# Altium schematic sheet Sheet1.SchDoc: =GlobalProjectName
size 410 x 297 mm; ApprovedBy: Королёв Д.М.; CheckedBy: Королёв Д.М.; Author: Тришин В.М.; Organization: СПбПУ 43328/1; DocumentNumber: МК 101801.001 Э3; SheetNumber: 1; SheetTotal: 1; PageSetup: Record=PageOptions|CenterHorizontal=True|CenterVertical=True|PrintScale=1.00|XCorrection=1.00|YCorrection=1.00|PrintKind=1|BorderSize=5000000|LeftOffset=0|BottomOffset=0|Orientation=2|PaperLength=1000|PaperWidth=1000|Scale=100|PaperSource=15|PrintQuality=1200|MediaType=1|DitherType=10|PaperKind=A3|PrintScaleMode=1; Weight: -; ScaleFactor: -
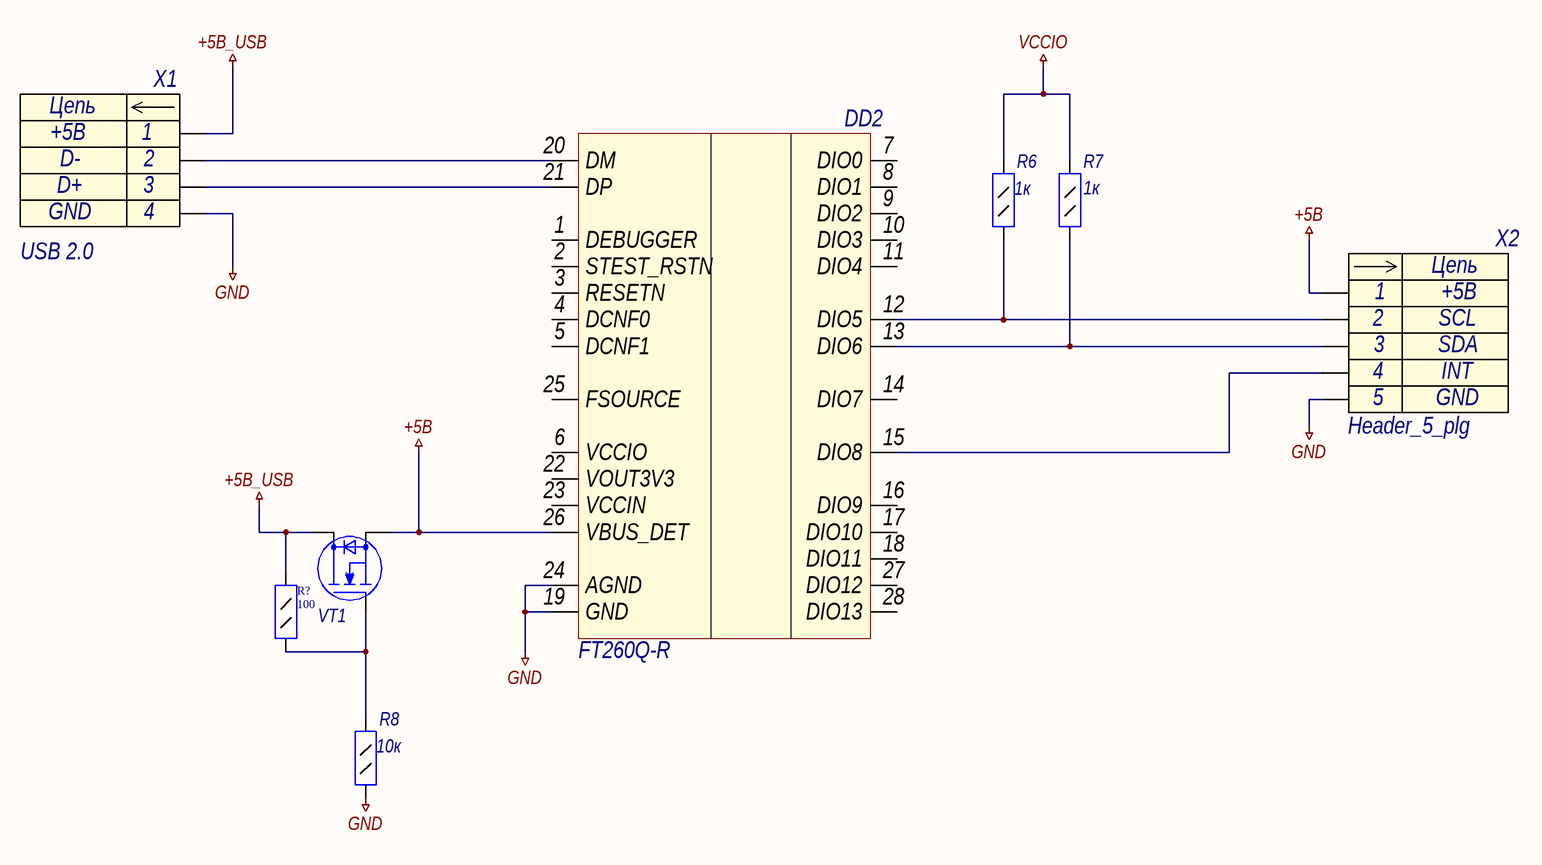
[diagram p0: Sheet1.SchDoc]

## Parts
DD2  FT260Q-R
R6  value 1к  [R0805]  (hidden comment: Resistor_0,125Вт)
R7  value 1к  [R0805]  (hidden comment: Resistor_0,125Вт)
R8  value 10к  [R0805]  (hidden comment: Resistor_0,125Вт)
R?  value 100  [R0805]  (hidden comment: Resistor_0,125Вт)
VT1  N-MOSFET  [SOT23-3]  (value not drawn)
X1  USB 2.0  [PLS-4]
X2  Header_5_plg  [PLS-5]

## Nets
+5В: DD2.26(VBUS_DET) VT1.2(S) X2.1
+5В_USB: R?.2 VT1.3(D) X1.1
GND: DD2.19(GND) DD2.24(AGND) R8.1 X1.4 X2.5
VCCIO: R6.2 R7.2
NetDD2_12: DD2.12(DIO5) R6.1 X2.2
NetDD2_13: DD2.13(DIO6) R7.1 X2.3
NetDD2_15: DD2.15(DIO8) X2.4
NetDD2_20: DD2.20(DM) X1.2
NetDD2_21: DD2.21(DP) X1.3
NetR8_2: R8.2 R?.1 VT1.1(G)

Not connected (* = marked no-connect by the designer): DD2 1(DEBUGGER) 2(STEST_RSTN) 3(RESETN) 4(DCNF0) 5(DCNF1) 6(VCCIO) 7(DIO0) 8(DIO1) 9(DIO2) 10(DIO3) 11(DIO4) 14(DIO7) 16(DIO9) 17(DIO10) 18(DIO11) 22(VOUT3V3) 23(VCCIN) 25(FSOURCE) 27(DIO12) 28(DIO13)

## Notes on the sheet
- Перв. примен.
- Справ. №
- Подп. и дата
- Инв. № дубл.
- Взам. инв. №
- Разраб.
- Изм.
- Лист
- № докум.
- Подп.
- Дата
- Литера
- Масса
- Масштаб
- Пров.
- Т.контр.
- Листов
- Инв. № подл.
- Н.контр.
- Утв.
- Форма 1 ГОСТ 2.104-2006
- Копировал
- Формат А3
- (in symbol connect6) Цепь
- (in symbol connect14) Цепь

## Library data of the parts
DD2 = FT260Q-R: IC BRIDGE USB TO UART/I2C 28WQFN; Manufacture: FTDI, Future Technology Devices International Ltd; Model: FT260Q-R; Case: 28-WQFN (5x5); HelpURL: https://www.digikey.com/product-detail/en/ftdi-future-technology-devices-international-ltd/FT260Q-R/FT260Q-RTR-ND/5956531
R6 R7 = res73: Резистор; id: res73; Accuracy: 1%; Part Name: Resistor; Power: 0,125Вт
R8 = res97: Резистор; id: res97; Accuracy: 1%; Part Name: Resistor; Power: 0,125Вт
R? = res49: Резистор; id: res49; Accuracy: 1%; Part Name: Resistor; Power: 0,125Вт
VT1 = trans2: Part Name: Transistor; Part Number: IRLML2402TRPBF; Manufacturer: International Rectifier; id: trans2; Structure: n-channel; V drain-source max: 20B; Rds: 0,25Ohm; Gate-to-source voltage: (+-)12B; Continuous drain current: 1,2A; Pulsed drain current: 7,4A; Power dissipation: 0,54W
X1 = connect14: Разъем - 4 конт. вилка; Part Number: DS1021-1*4SF112-B; Manufacture: Ningbo connfly electronic; Contact_1: +5В; Contact_2: D-; Contact_3: D+; Contact_4: GND; Etch: 2,54mm; Part Name: PLS-4; id: connect14
X2 = connect6: Разъем - 5 конт. вилка; Part Number: DS1021-1*5SF112-B; Manufacture: Ningbo connfly electronic; Contact_1: +5В; Contact_2: SCL; Contact_3: SDA; Contact_4: INT; Contact_5: GND; Etch: 2,54mm; Part Name: PLS-5; id: connect6